# Altium schematic sheet obc-v2_USB-HUB.SchDoc
size 420 x 297 mm; SheetNumber: 10; SheetTotal: 21
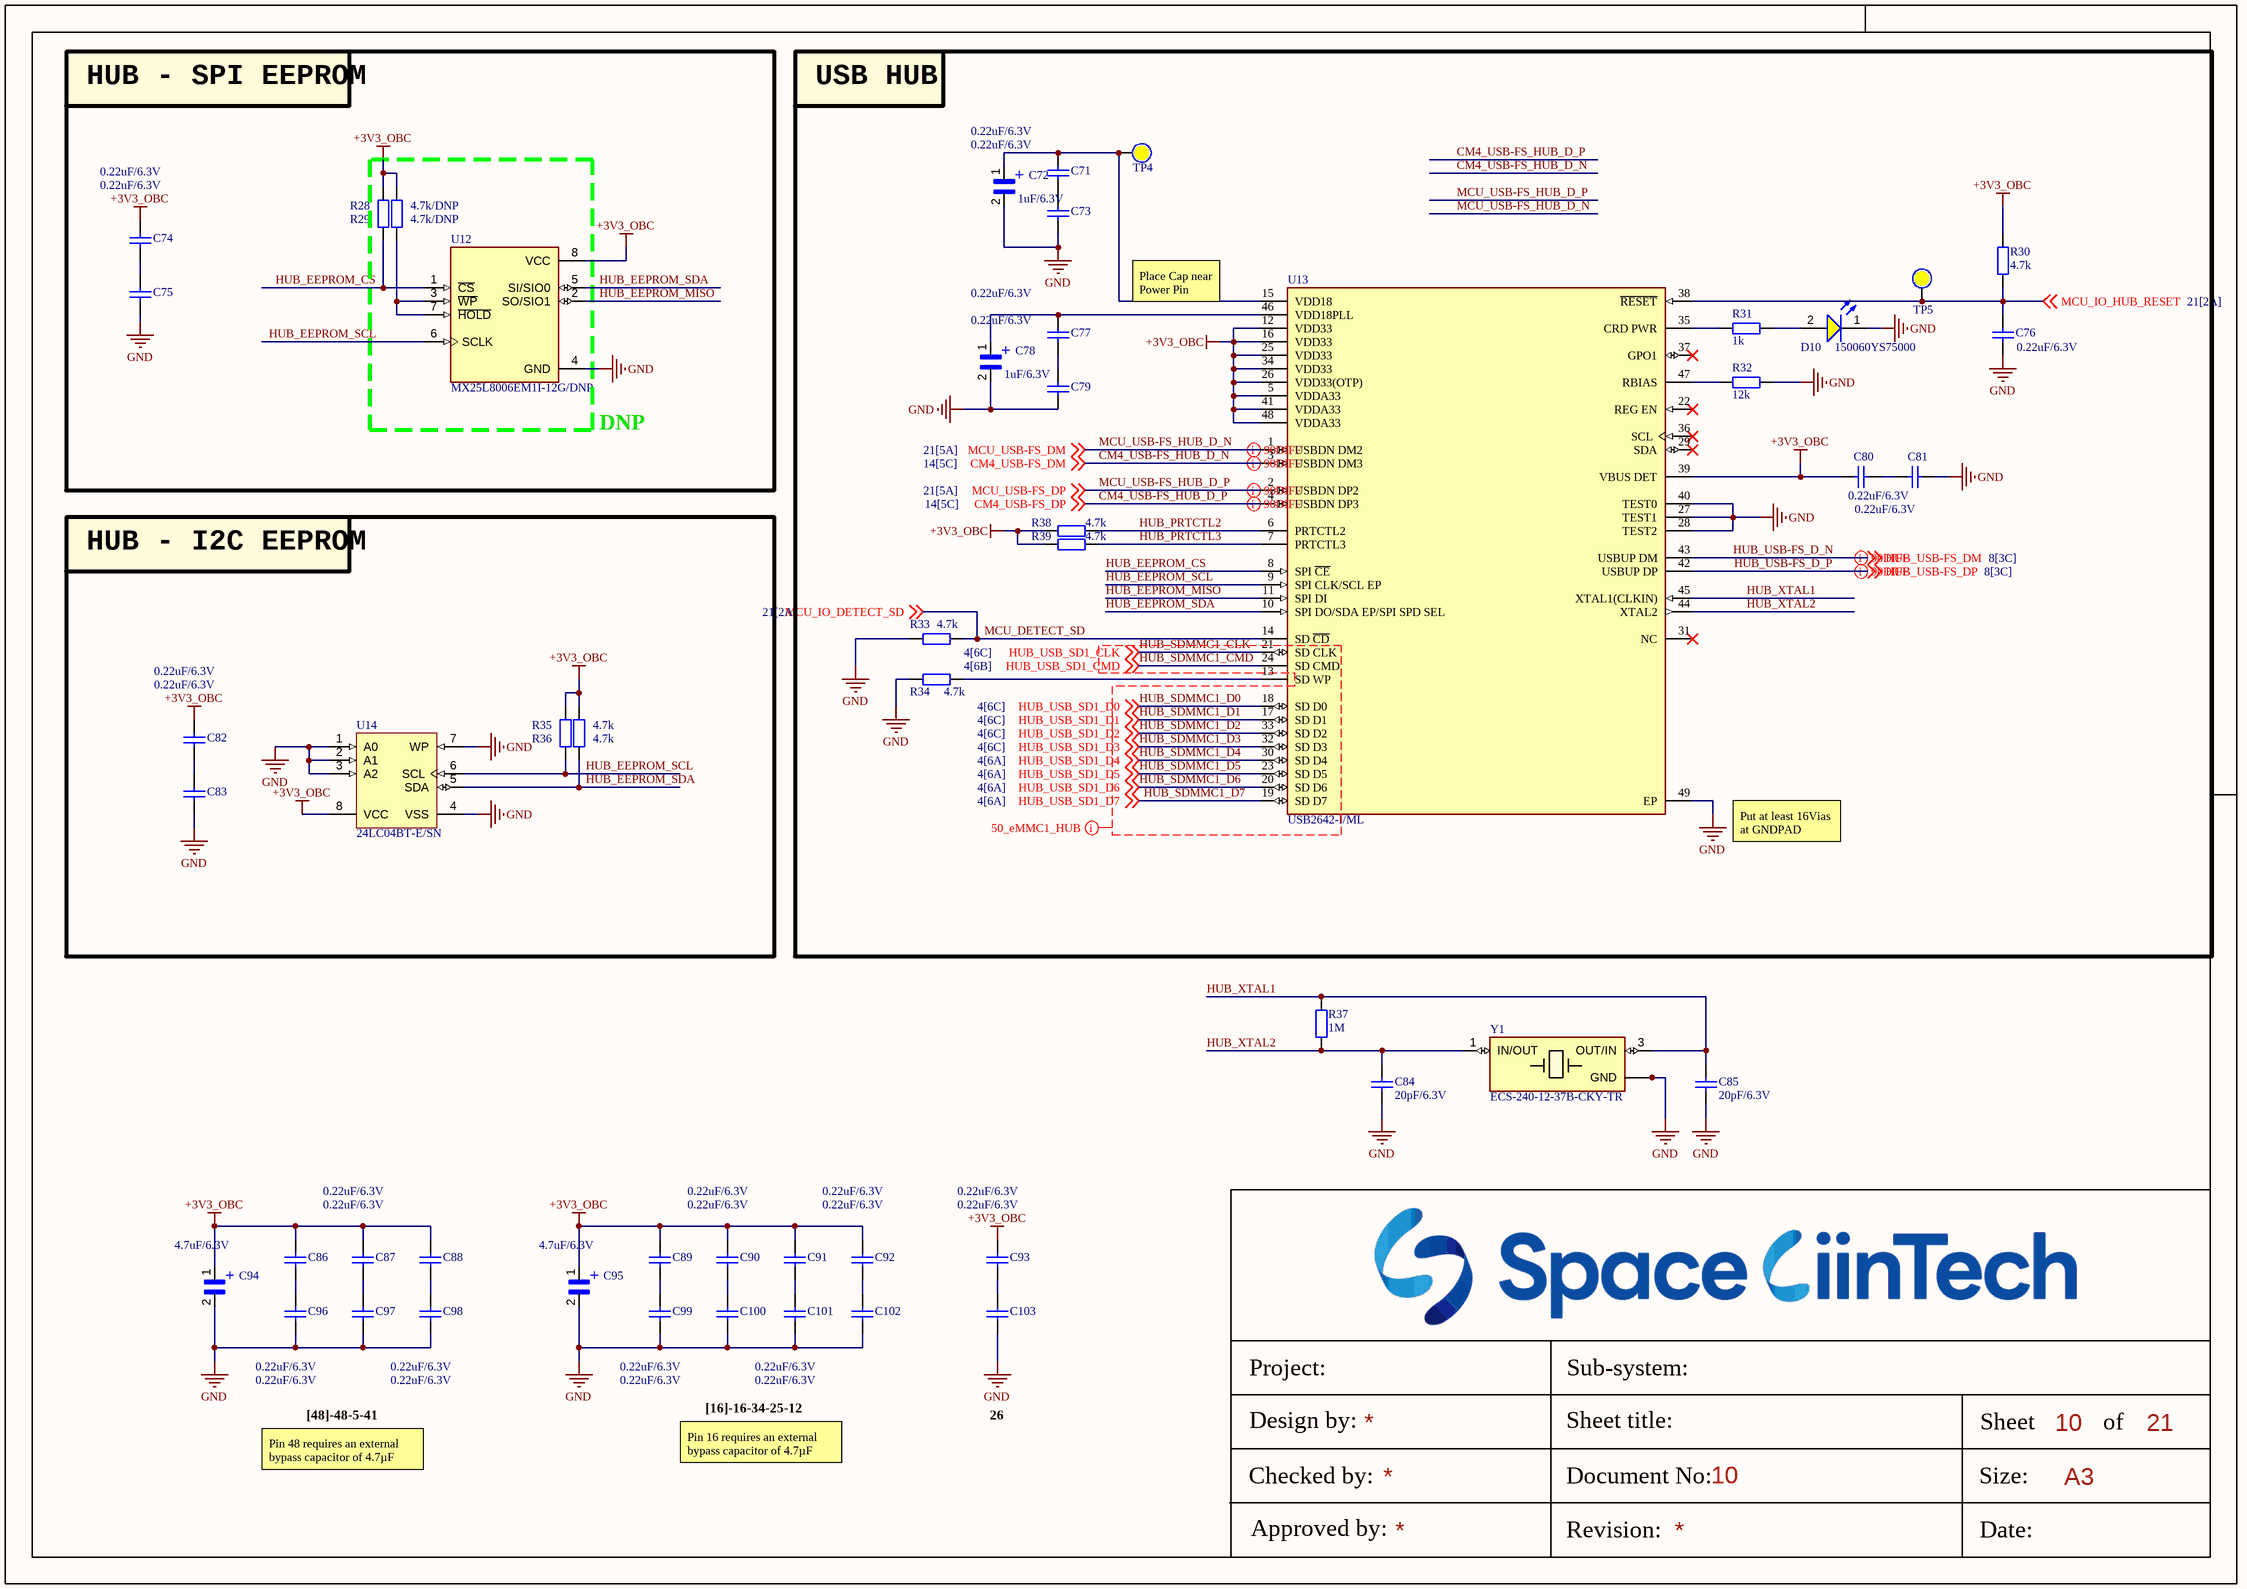
[diagram p0: obc-v2_USB-HUB.SchDoc]

## Parts
C71  0.22uF/6.3V  [CAP_C_1005X60]
C72  1uF/6.3V  [CAP_MP_1608X90]
C73  0.22uF/6.3V  [CAP_C_1005X60]
C74  0.22uF/6.3V  [CAP_C_1005X60]
C75  0.22uF/6.3V  [CAP_C_1005X60]
C76  0.22uF/6.3V  [CAP_C_1005X60]
C77  0.22uF/6.3V  [CAP_C_1005X60]
C78  1uF/6.3V  [CAP_MP_1608X90]
C79  0.22uF/6.3V  [CAP_C_1005X60]
C80  0.22uF/6.3V  [CAP_C_1005X60]
C81  0.22uF/6.3V  [CAP_C_1005X60]
C82  0.22uF/6.3V  [CAP_C_1005X60]
C83  0.22uF/6.3V  [CAP_C_1005X60]
C84  20pF/6.3V  [CAP_C_1005X60]
C85  20pF/6.3V  [CAP_C_1005X60]
C86  0.22uF/6.3V  [CAP_C_1005X60]
C87  0.22uF/6.3V  [CAP_C_1005X60]
C88  0.22uF/6.3V  [CAP_C_1005X60]
C89  0.22uF/6.3V  [CAP_C_1005X60]
C90  0.22uF/6.3V  [CAP_C_1005X60]
C91  0.22uF/6.3V  [CAP_C_1005X60]
C92  0.22uF/6.3V  [CAP_C_1005X60]
C93  0.22uF/6.3V  [CAP_C_1005X60]
C94  4.7uF/6.3V  [CAP_MP_1608X90]
C95  4.7uF/6.3V  [CAP_MP_1608X90]
C96  0.22uF/6.3V  [CAP_C_1005X60]
C97  0.22uF/6.3V  [CAP_C_1005X60]
C98  0.22uF/6.3V  [CAP_C_1005X60]
C99  0.22uF/6.3V  [CAP_C_1005X60]
C100  0.22uF/6.3V  [CAP_C_1005X60]
C101  0.22uF/6.3V  [CAP_C_1005X60]
C102  0.22uF/6.3V  [CAP_C_1005X60]
C103  0.22uF/6.3V  [CAP_C_1005X60]
D10  150060YS75000  [WL-SMCW_0603_150060xx75000]
R28  4.7k/DNP  [RES_C_1608X60]
R29  4.7k/DNP  [RES_C_1608X60]
R30  4.7k  [RES_C_1608X60]
R31  1k  [RES_C_1608X60]
R32  12k  [RES_C_1608X60]
R33  4.7k  [RES_C_1608X60]
R34  4.7k  [RES_C_1608X60]
R35  4.7k  [RES_C_1608X60]
R36  4.7k  [RES_C_1608X60]
R37  1M  [RES_C_1608X60]
R38  4.7k  [RES_C_1608X60]
R39  4.7k  [RES_C_1608X60]
TP4  (no value)  [Test Point 1 Side]  (no BOM)
TP5  (no value)  [Test Point 1 Side]  (no BOM)
U12  MX25L8006EM1I-12G/DNP  [SOIC127P602X173-8N]
U13  USB2642-I/ML  [FP-48QFN-5304-7x7B-IPC_A]
U14  24LC04BT-E/SN  [SOIC-SN8_L]
Y1  ECS-240-12-37B-CKY-TR  [XTAL_ECS-240-12-37B-CKY-TR]

## Blocks framed on the sheet
HUB - SPI EEPROM: C74 C75 R28 R29 U12
USB HUB: C71-C73 C76-C81 D10 R30-R34 R38 R39 TP4 TP5 U13
HUB - I2C EEPROM: C82 C83 R35 R36 U14

## Nets
+3V3_OBC: C74.1 C80.1 C82.1 C86.1 C87.1 C88.1 C89.1 C90.1 C91.1 C92.1 C93.1 C94.1 C95.1 R28.2 R29.2 R30.1 R35.2 R36.2 R38.1 R39.1 U12.8(VCC) U13.5(VDDA33) U13.12(VDD33) U13.16(VDD33) U13.25(VDD33) U13.26(VDD33(OTP)) U13.34(VDD33) U13.39(VBUS_DET) U13.41(VDDA33) U13.48(VDDA33) U14.8(VCC)
GND: C72.2 C73.1 C75.2 C76.2 C78.2 C79.1 C81.2 C83.2 C84.1 C85.1 C94.2 C95.2 C96.2 C97.2 C98.2 C99.2 C100.2 C101.2 C102.2 C103.2 D10.1(K) R32.2 R33.1 R34.1 U12.4(GND) U13.27(TEST1) U13.28(TEST2) U13.40(TEST0) U13.49(EP) U14.1(A0) U14.2(A1) U14.3(A2) U14.4(VSS) U14.7(WP) Y1.2(GND) Y1.4(GND)
CM4_USB-FS_HUB_D_N: U13.3(USBDN_DM3) ; off-sheet CM4_USB-FS_DM  [also labelled CM4_USB-FS_DM]
CM4_USB-FS_HUB_D_P: U13.4(USBDN_DP3) ; off-sheet CM4_USB-FS_DP  [also labelled CM4_USB-FS_DP]
HUB_EEPROM_CS: R29.1 U12.1(~{CS}) U13.8(SPI_~{CE})
HUB_EEPROM_MISO: U12.2(SO/SIO1) U13.11(SPI_DI)
HUB_EEPROM_SCL: R36.1 U12.6(SCLK) U13.9(SPI_CLK/SCL_EP) U14.6(SCL)
HUB_EEPROM_SDA: R35.1 U12.5(SI/SIO0) U13.10(SPI_DO/SDA_EP/SPI_SPD_SEL) U14.5(SDA)
HUB_PRTCTL2: R38.2 U13.6(PRTCTL2)
HUB_PRTCTL3: R39.2 U13.7(PRTCTL3)
HUB_SDMMC1_CLK: U13.21(SD_CLK) ; off-sheet HUB_USB_SD1_CLK  [also labelled HUB_USB_SD1_CLK]
HUB_SDMMC1_CMD: U13.24(SD_CMD) ; off-sheet HUB_USB_SD1_CMD  [also labelled HUB_USB_SD1_CMD]
HUB_SDMMC1_D0: U13.18(SD_D0) ; off-sheet HUB_USB_SD1_D0  [also labelled HUB_USB_SD1_D0]
HUB_SDMMC1_D1: U13.17(SD_D1) ; off-sheet HUB_USB_SD1_D1  [also labelled HUB_USB_SD1_D1]
HUB_SDMMC1_D2: U13.33(SD_D2) ; off-sheet HUB_USB_SD1_D2  [also labelled HUB_USB_SD1_D2]
HUB_SDMMC1_D3: U13.32(SD_D3) ; off-sheet HUB_USB_SD1_D3  [also labelled HUB_USB_SD1_D3]
HUB_SDMMC1_D4: U13.30(SD_D4) ; off-sheet HUB_USB_SD1_D4  [also labelled HUB_USB_SD1_D4]
HUB_SDMMC1_D5: U13.23(SD_D5) ; off-sheet HUB_USB_SD1_D5  [also labelled HUB_USB_SD1_D5]
HUB_SDMMC1_D6: U13.20(SD_D6) ; off-sheet HUB_USB_SD1_D6  [also labelled HUB_USB_SD1_D6]
HUB_SDMMC1_D7: U13.19(SD_D7) ; off-sheet HUB_USB_SD1_D7  [also labelled HUB_USB_SD1_D7]
HUB_USB-FS_D_N: U13.43(USBUP_DM) ; off-sheet HUB_USB-FS_DM  [also labelled HUB_USB-FS_DM]
HUB_USB-FS_D_P: U13.42(USBUP_DP) ; off-sheet HUB_USB-FS_DP  [also labelled HUB_USB-FS_DP]
HUB_XTAL1: C85.2 R37.2 U13.45(XTAL1(CLKIN)) Y1.3(OUT/IN)
HUB_XTAL2: C84.2 R37.1 U13.44(XTAL2) Y1.1(IN/OUT)
MCU_DETECT_SD: R33.2 U13.14(SD_~{CD}) ; off-sheet MCU_IO_DETECT_SD  [also labelled MCU_IO_DETECT_SD]
MCU_IO_HUB_RESET: C76.1 R30.2 TP5.0 U13.38(~{RESET}) ; off-sheet MCU_IO_HUB_RESET
MCU_USB-FS_HUB_D_N: U13.1(USBDN_DM2) ; off-sheet MCU_USB-FS_DM  [also labelled MCU_USB-FS_DM]
MCU_USB-FS_HUB_D_P: U13.2(USBDN_DP2) ; off-sheet MCU_USB-FS_DP  [also labelled MCU_USB-FS_DP]
NetC71_1: C71.1 C73.2
NetC71_2: C71.2 C72.1 TP4.0 U13.15(VDD18)
NetC74_2: C74.2 C75.1
NetC77_1: C77.1 C79.2
NetC77_2: C77.2 C78.1 U13.46(VDD18PLL)
NetC80_2: C80.2 C81.1
NetC82_2: C82.2 C83.1
NetC86_2: C86.2 C96.1
NetC87_2: C87.2 C97.1
NetC88_2: C88.2 C98.1
NetC89_2: C89.2 C99.1
NetC90_2: C90.2 C100.1
NetC91_2: C91.2 C101.1
NetC92_2: C92.2 C102.1
NetC93_2: C93.2 C103.1
NetD10_2: D10.2(A) R31.1
NetR28_1: R28.1 U12.3(~{WP}) U12.7(~{HOLD})
NetR31_2: R31.2 U13.35(CRD_PWR)
NetR32_1: R32.1 U13.47(RBIAS)
NetR34_2: R34.2 U13.13(SD_WP)

Not connected (* = marked no-connect by the designer): U13 22(REG_EN)* 29(SDA)* 31(NC)* 36(SCL)* 37(GPO1)*

## Layout directives
net class 50_eMMC1_HUB: HUB_SDMMC1_CLK, HUB_SDMMC1_CMD, HUB_SDMMC1_D0, HUB_SDMMC1_D1, HUB_SDMMC1_D2, HUB_SDMMC1_D3, HUB_SDMMC1_D4, HUB_SDMMC1_D5, HUB_SDMMC1_D6, HUB_SDMMC1_D7, HUB_USB_SD1_CLK, HUB_USB_SD1_CMD, HUB_USB_SD1_D0, HUB_USB_SD1_D1, HUB_USB_SD1_D2, HUB_USB_SD1_D3, HUB_USB_SD1_D4, HUB_USB_SD1_D5, HUB_USB_SD1_D6, HUB_USB_SD1_D7
differential pair; differential pair class DIFF90: CM4_USB-FS_HUB_D_N, CM4_USB-FS_HUB_D_P, HUB_USB-FS_D_N, HUB_USB-FS_D_P, MCU_USB-FS_HUB_D_N, MCU_USB-FS_HUB_D_P

## Notes on the sheet
- Place Cap near Power Pin
- DNP
- Put at least 16Vias at GNDPAD
- [16]-16-34-25-12
- Pin 48 requires an external bypass capacitor of 4.7µF minimum.
- [48]-48-5-41
- Pin 16 requires an external bypass capacitor of 4.7µF minimum.
- 26
- Project:
- Sub-system:
- Design by:
- Sheet title:
- Sheet
- A3
- of
- Checked by:
- Approved by:
- Revision:
- Document No:
- Size:
- Date:
- (in symbol TACL335M003RTA) +

## Library data of the parts
C71 C73-C77 C79-C93 C96-C103 = Tu 0402 33nF 10V: CAPC; Chung_Loai: Dán; Don_Vi: Con; So_Chan: 2; Ten_Linh_Kien: Tụ 0402 33nF X7R 10V GRM155R71A333KA01D; Ma_Hang: MH007853; Kieu_Chan: *
C72 C78 C94 C95 = TACL335M003RTA: CAPP; Package: None; Price: None; Value: *; MP: TACL335M003RTA; Availability: Unavailable
D10 = CMP-1426-00005-2: LED YELLOW CLEAR 0603 SMD; NexarPartId: 29687085; Wavelength: 590nm; Luminous Intensity: 120mcd; Peak Wavelength: 595nm; Forward Current: 100mA; Power Dissipation: 72mW; Forward Voltage: 2V; Test Current: 20mA; Reverse Voltage: 5V; Lens Style: Clear, Rectangular; Max Junction Temperature (Tj): 95°C; Viewing Angle: 140°; Case Code (Imperial): 0603; Height: 700µm; REACH SVHC: Unknown; Dominant Wavelength: 590nm; Min Operating Temperature: -40°C; Color: Yellow; Width: 800µm; Mount: Surface Mount; Packaging: Tape and Reel; Max Operating Temperature: 85°C; RoHS: Compliant; Max Reverse Voltage (DC): 5V; Case Code (Metric): 1608; Length: 1.6mm; Case/Package: 0603
R28-R31 R33-R36 R38 R39 = Tro 0603 1% 10k: RES; Chung_Loai: Dán; Don_Vi: Con; So_Chan: 2; Ten_Linh_Kien: Trở 0603 1% 10k; Ma_Hang: MH006333; Kieu_Chan: *
R32 R37 = Tro 0603 1% 1k: RES SMD 12K OHM 1% 1/10W 0603, P/N: ERJ-3EKF1202V; Chung_Loai: Dán; So_Chan: 2; Don_Vi: Con; Ten_Linh_Kien: Trở 0603 1% 1k; Ma_Hang: MH006334; Kieu_Chan: *
TP4 TP5 = Test Point: Solder: NF
U12 = MX25L8006EM1I-12G: FLASH - NOR Memory IC 8Mb (1M x 8) SPI 86 MHz 8-SOP; MF: Macronix; SnapEDA_Link: https://www.snapeda.com/parts/MX25L8006EM1I-12G/Macronix/view-part/?ref=snap; Package: SOP-8 Macronix; Value: *; MP: MX25L8006EM1I-12G; Check_prices: https://www.snapeda.com/parts/MX25L8006EM1I-12G/Macronix/view-part/?ref=eda
U13 = CMP-06284-000083-1: IC INTERFACE SPECIALIZED 48QFN; Data Rate: 480Mbps; Interface: I2C; Number of Ports: 2; Operating Supply Voltage: 3.3V; Case/Package: QFN; Series: -; RoHS Compliant: Yes; Number of Pins: 48; Packaging: Tray; Package Quantity: 260; Max Operating Temperature: 85°C; Weight: 0.005309oz; Mount: Surface Mount; Min Operating Temperature: -40°C
U14 = CMP-0159-00349-1: 4Kbit, 400kHz, 2.5V, I2C Serial EEPROM, 8-Pin SOIC 150mil, Extended Temperature, Tape and Reel; Code_IPC: SOIC127P600-8; Code_JEDEC: MS-012; PackageVersion: revBB, Aug-2009; DatasheetVersion: revK, Mar-2009; PackageDescription: 8-Lead Plastic Small Outline (SN) - Narrow, 3.90mm Body [SOIC]; PackageReference: SOIC-SN8
Y1 = ECS-240-12-37B-CKY-TR: Package: None; Price: None; Value: *; MP: ECS-240-12-37B-CKY-TR; Availability: Unavailable